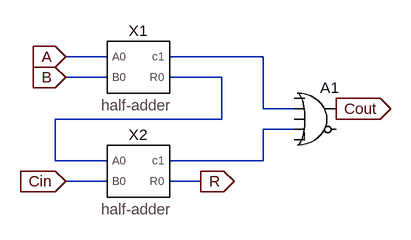
[diagram p0: schematic full_adder.asc]
full_adder.asc, the LTspice schematic file:
Version 4
SHEET 1 880 680
WIRE 32 144 -32 144
WIRE 272 144 128 144
WIRE 32 176 -32 176
WIRE 208 176 128 176
WIRE 272 224 272 144
WIRE 320 224 272 224
WIRE 208 240 208 176
WIRE 208 240 -48 240
WIRE 320 256 272 256
WIRE -48 304 -48 240
WIRE 32 304 -48 304
WIRE 272 304 272 256
WIRE 272 304 128 304
WIRE 32 336 -32 336
WIRE 176 336 128 336
FLAG -32 144 A
IOPIN -32 144 In
FLAG -32 176 B
IOPIN -32 176 In
FLAG 176 336 R
IOPIN 176 336 Out
FLAG -32 336 Cin
IOPIN -32 336 In
FLAG 384 224 Cout
IOPIN 384 224 Out
SYMBOL half_adder 80 160 R0
SYMATTR InstName X1
SYMBOL half_adder 80 320 R0
SYMATTR InstName X2
SYMBOL Digital\\or 352 176 R0
SYMATTR InstName A1

The netlist it stands for:
* full_adder.asc
XX1 A B N001 N002 half-adder  ; pins A0 B0 c1 R0
XX2 N002 Cin N003 R half-adder  ; pins A0 B0 c1 R0
A1 0 N001 0 N003 0 0 Cout 0 OR
.backanno
.end